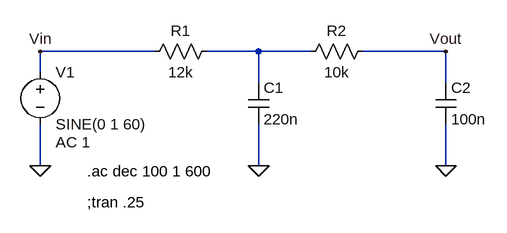
[diagram p0: schematic SubBassFilter2ndOrder.asc]
SubBassFilter2ndOrder.asc, the LTspice schematic file:
Version 4
SHEET 1 880 680
WIRE 240 80 64 80
WIRE 400 80 320 80
WIRE 480 80 400 80
WIRE 688 80 560 80
WIRE 64 112 64 80
WIRE 400 128 400 80
WIRE 688 128 688 80
WIRE 64 256 64 192
WIRE 400 256 400 192
WIRE 688 256 688 192
FLAG 64 256 0
FLAG 400 256 0
FLAG 64 80 Vin
FLAG 688 256 0
FLAG 688 80 Vout
SYMBOL res 336 64 R90
WINDOW 0 0 56 VBottom 2
WINDOW 3 32 56 VTop 2
SYMATTR InstName R1
SYMATTR Value 12k
SYMBOL cap 384 128 R0
SYMATTR InstName C1
SYMATTR Value 220n
SYMBOL voltage 64 96 R0
WINDOW 123 24 124 Left 2
WINDOW 39 0 0 Left 0
SYMATTR InstName V1
SYMATTR Value SINE(0 1 60)
SYMATTR Value2 AC 1
SYMBOL cap 672 128 R0
SYMATTR InstName C2
SYMATTR Value 100n
SYMBOL res 576 64 R90
WINDOW 0 0 56 VBottom 2
WINDOW 3 32 56 VTop 2
SYMATTR InstName R2
SYMATTR Value 10k
TEXT 136 264 Left 2 !.ac dec 100 1 600
TEXT 136 312 Left 2 !;tran .25

The netlist it stands for:
* SubBassFilter2ndOrder.asc
R1 N001 Vin 12k
C1 N001 0 220n
V1 Vin 0 SINE(0 1 60) AC 1
C2 Vout 0 100n
R2 Vout N001 10k
.ac dec 100 1 600
;tran .25
.backanno
.end